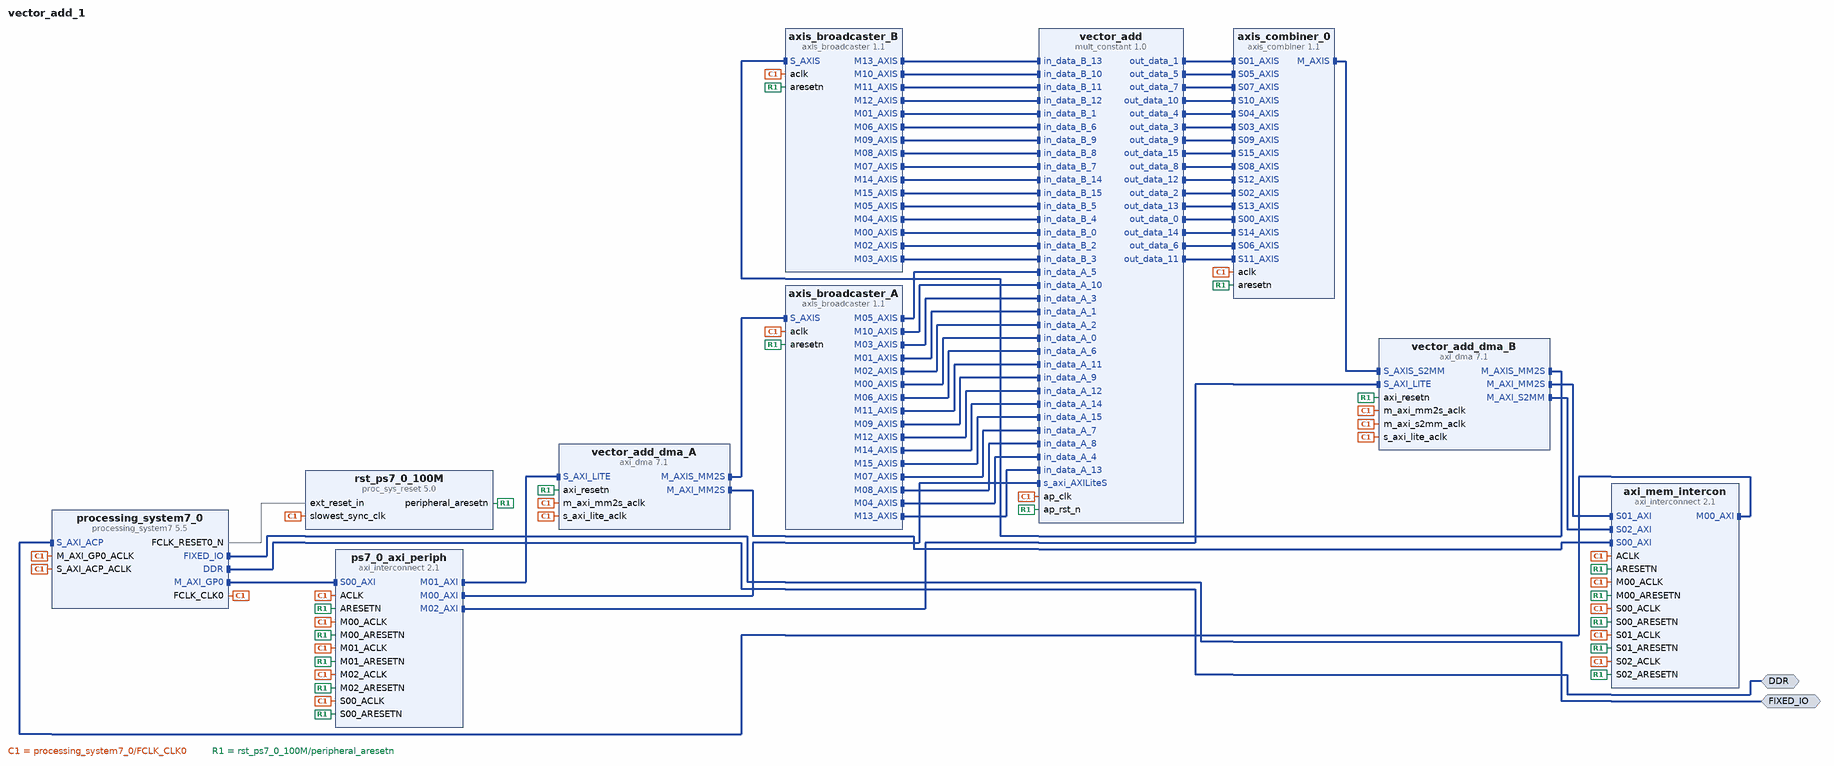
[diagram p0: block diagram of the top level]
# Vivado block design vector_add_1, xc7z020clg400-1, Vivado 2019.2
create_bd_design vector_add_1

create_bd_intf_port -mode Master -vlnv xilinx.com:interface:ddrx_rtl:1.0 DDR
create_bd_intf_port -mode Master -vlnv xilinx.com:display_processing_system7:fixedio_rtl:1.0 FIXED_IO

create_bd_cell -type ip -vlnv xilinx.com:ip:processing_system7:5.5 processing_system7_0
set_property -dict [list \
  CONFIG.PCW_APU_PERIPHERAL_FREQMHZ 650 \
  CONFIG.PCW_CRYSTAL_PERIPHERAL_FREQMHZ 50 \
  CONFIG.PCW_ENET0_ENET0_IO {MIO 16 .. 27} \
  CONFIG.PCW_ENET0_GRP_MDIO_ENABLE 1 \
  CONFIG.PCW_ENET0_GRP_MDIO_IO {MIO 52 .. 53} \
  CONFIG.PCW_ENET0_PERIPHERAL_ENABLE 1 \
  CONFIG.PCW_ENET0_RESET_ENABLE 1 \
  CONFIG.PCW_ENET0_RESET_IO {MIO 9} \
  CONFIG.PCW_ENET_RESET_ENABLE 1 \
  CONFIG.PCW_ENET_RESET_SELECT {Share reset pin} \
  CONFIG.PCW_FPGA0_PERIPHERAL_FREQMHZ 100 \
  CONFIG.PCW_FPGA1_PERIPHERAL_FREQMHZ 50 \
  CONFIG.PCW_GPIO_MIO_GPIO_ENABLE 1 \
  CONFIG.PCW_GPIO_MIO_GPIO_IO MIO \
  CONFIG.PCW_I2C_RESET_ENABLE 1 \
  CONFIG.PCW_M_AXI_GP0_FREQMHZ 10 \
  CONFIG.PCW_PERIPHERAL_BOARD_PRESET None \
  CONFIG.PCW_PRESET_BANK1_VOLTAGE {LVCMOS 1.8V} \
  CONFIG.PCW_QSPI_GRP_FBCLK_ENABLE 1 \
  CONFIG.PCW_QSPI_GRP_FBCLK_IO {MIO 8} \
  CONFIG.PCW_QSPI_GRP_SINGLE_SS_ENABLE 1 \
  CONFIG.PCW_QSPI_GRP_SINGLE_SS_IO {MIO 1 .. 6} \
  CONFIG.PCW_QSPI_PERIPHERAL_ENABLE 1 \
  CONFIG.PCW_QSPI_QSPI_IO {MIO 1 .. 6} \
  CONFIG.PCW_SD0_GRP_CD_ENABLE 1 \
  CONFIG.PCW_SD0_GRP_CD_IO {MIO 47} \
  CONFIG.PCW_SD0_GRP_WP_ENABLE 0 \
  CONFIG.PCW_SD0_PERIPHERAL_ENABLE 1 \
  CONFIG.PCW_SD0_SD0_IO {MIO 40 .. 45} \
  CONFIG.PCW_SDIO_PERIPHERAL_FREQMHZ 50 \
  CONFIG.PCW_SINGLE_QSPI_DATA_MODE x4 \
  CONFIG.PCW_UART0_PERIPHERAL_ENABLE 1 \
  CONFIG.PCW_UART0_UART0_IO {MIO 14 .. 15} \
  CONFIG.PCW_UART1_PERIPHERAL_ENABLE 0 \
  CONFIG.PCW_UART_PERIPHERAL_FREQMHZ 100 \
  CONFIG.PCW_UIPARAM_DDR_BUS_WIDTH {16 Bit} \
  CONFIG.PCW_UIPARAM_DDR_FREQ_MHZ 525 \
  CONFIG.PCW_UIPARAM_DDR_PARTNO {MT41J256M16 RE-125} \
  CONFIG.PCW_USB0_PERIPHERAL_ENABLE 1 \
  CONFIG.PCW_USB0_RESET_ENABLE 1 \
  CONFIG.PCW_USB0_RESET_IO {MIO 46} \
  CONFIG.PCW_USB0_USB0_IO {MIO 28 .. 39} \
  CONFIG.PCW_USB_RESET_ENABLE 1 \
  CONFIG.PCW_USB_RESET_SELECT {Share reset pin} \
  CONFIG.PCW_USE_S_AXI_ACP 1 \
] [get_bd_cells processing_system7_0]
# 483 more settings of processing_system7_0 are not shown: defaults, MIO pin electricals, DDR timing, and values the tool derives
create_bd_cell -type ip -vlnv xilinx.com:ip:axi_dma:7.1 vector_add_dma_A
set_property -dict [list \
  CONFIG.c_include_s2mm 0 \
  CONFIG.c_include_sg 0 \
  CONFIG.c_m_axi_mm2s_data_width 512 \
  CONFIG.c_m_axis_mm2s_tdata_width 512 \
  CONFIG.c_mm2s_burst_size 32 \
] [get_bd_cells vector_add_dma_A]
create_bd_cell -type ip -vlnv Xilinx:hls:mult_constant:1.0 vector_add
create_bd_cell -type ip -vlnv xilinx.com:ip:axis_broadcaster:1.1 axis_broadcaster_A
set_property -dict [list \
  CONFIG.HAS_TLAST 1 \
  CONFIG.M00_TDATA_REMAP {tdata[31:0]} \
  CONFIG.M01_TDATA_REMAP {tdata[63:32]} \
  CONFIG.M02_TDATA_REMAP {tdata[95:64]} \
  CONFIG.M03_TDATA_REMAP {tdata[127:96]} \
  CONFIG.M04_TDATA_REMAP {tdata[159:128]} \
  CONFIG.M05_TDATA_REMAP {tdata[191:160]} \
  CONFIG.M06_TDATA_REMAP {tdata[223:192]} \
  CONFIG.M07_TDATA_REMAP {tdata[255:224]} \
  CONFIG.M08_TDATA_REMAP {tdata[287:256]} \
  CONFIG.M09_TDATA_REMAP {tdata[319:288]} \
  CONFIG.M10_TDATA_REMAP {tdata[351:320]} \
  CONFIG.M11_TDATA_REMAP {tdata[383:352]} \
  CONFIG.M12_TDATA_REMAP {tdata[415:384]} \
  CONFIG.M13_TDATA_REMAP {tdata[447:416]} \
  CONFIG.M14_TDATA_REMAP {tdata[479:448]} \
  CONFIG.M15_TDATA_REMAP {tdata[511:480]} \
  CONFIG.M_TDATA_NUM_BYTES 4 \
  CONFIG.NUM_MI 16 \
  CONFIG.S_TDATA_NUM_BYTES 64 \
] [get_bd_cells axis_broadcaster_A]
create_bd_cell -type ip -vlnv xilinx.com:ip:axis_broadcaster:1.1 axis_broadcaster_B
set_property -dict [list \
  CONFIG.HAS_TLAST 1 \
  CONFIG.M00_TDATA_REMAP {tdata[31:0]} \
  CONFIG.M01_TDATA_REMAP {tdata[63:32]} \
  CONFIG.M02_TDATA_REMAP {tdata[95:64]} \
  CONFIG.M03_TDATA_REMAP {tdata[127:96]} \
  CONFIG.M04_TDATA_REMAP {tdata[159:128]} \
  CONFIG.M05_TDATA_REMAP {tdata[191:160]} \
  CONFIG.M06_TDATA_REMAP {tdata[223:192]} \
  CONFIG.M07_TDATA_REMAP {tdata[255:224]} \
  CONFIG.M08_TDATA_REMAP {tdata[287:256]} \
  CONFIG.M09_TDATA_REMAP {tdata[319:288]} \
  CONFIG.M10_TDATA_REMAP {tdata[351:320]} \
  CONFIG.M11_TDATA_REMAP {tdata[383:352]} \
  CONFIG.M12_TDATA_REMAP {tdata[415:384]} \
  CONFIG.M13_TDATA_REMAP {tdata[447:416]} \
  CONFIG.M14_TDATA_REMAP {tdata[479:448]} \
  CONFIG.M15_TDATA_REMAP {tdata[511:480]} \
  CONFIG.M_TDATA_NUM_BYTES 4 \
  CONFIG.NUM_MI 16 \
  CONFIG.S_TDATA_NUM_BYTES 64 \
] [get_bd_cells axis_broadcaster_B]
create_bd_cell -type ip -vlnv xilinx.com:ip:axi_dma:7.1 vector_add_dma_B
set_property -dict [list \
  CONFIG.c_include_sg 0 \
  CONFIG.c_m_axi_mm2s_data_width 512 \
  CONFIG.c_m_axi_s2mm_data_width 512 \
  CONFIG.c_m_axis_mm2s_tdata_width 512 \
  CONFIG.c_mm2s_burst_size 32 \
  CONFIG.c_s2mm_burst_size 32 \
  CONFIG.c_s_axis_s2mm_tdata_width 512 \
] [get_bd_cells vector_add_dma_B]
create_bd_cell -type ip -vlnv xilinx.com:ip:axis_combiner:1.1 axis_combiner_0
set_property -dict [list \
  CONFIG.HAS_TKEEP 1 \
  CONFIG.HAS_TLAST 1 \
  CONFIG.NUM_SI 16 \
  CONFIG.TDATA_NUM_BYTES 4 \
] [get_bd_cells axis_combiner_0]
create_bd_cell -type ip -vlnv xilinx.com:ip:proc_sys_reset:5.0 rst_ps7_0_100M
create_bd_cell -type ip -vlnv xilinx.com:ip:axi_interconnect:2.1 axi_mem_intercon
set_property -dict {CONFIG.NUM_MI 1 CONFIG.NUM_SI 3} [get_bd_cells axi_mem_intercon]
create_bd_cell -type ip -vlnv xilinx.com:ip:axi_interconnect:2.1 ps7_0_axi_periph
set_property -dict {CONFIG.NUM_MI 3} [get_bd_cells ps7_0_axi_periph]

# ---- connections ----

connect_bd_intf_net [get_bd_intf_pins axis_broadcaster_B/M13_AXIS] [get_bd_intf_pins vector_add/in_data_B_13]
connect_bd_intf_net [get_bd_intf_pins axis_broadcaster_B/M10_AXIS] [get_bd_intf_pins vector_add/in_data_B_10]
connect_bd_intf_net [get_bd_intf_pins axis_broadcaster_B/M11_AXIS] [get_bd_intf_pins vector_add/in_data_B_11]
connect_bd_intf_net [get_bd_intf_pins axis_broadcaster_B/M12_AXIS] [get_bd_intf_pins vector_add/in_data_B_12]
connect_bd_intf_net [get_bd_intf_pins axis_broadcaster_B/M01_AXIS] [get_bd_intf_pins vector_add/in_data_B_1]
connect_bd_intf_net [get_bd_intf_pins axis_broadcaster_B/M06_AXIS] [get_bd_intf_pins vector_add/in_data_B_6]
connect_bd_intf_net [get_bd_intf_pins axis_broadcaster_B/M09_AXIS] [get_bd_intf_pins vector_add/in_data_B_9]
connect_bd_intf_net [get_bd_intf_pins axis_broadcaster_B/M08_AXIS] [get_bd_intf_pins vector_add/in_data_B_8]
connect_bd_intf_net [get_bd_intf_pins vector_add_dma_A/M_AXIS_MM2S] [get_bd_intf_pins axis_broadcaster_A/S_AXIS]
connect_bd_intf_net [get_bd_intf_pins axis_broadcaster_B/M07_AXIS] [get_bd_intf_pins vector_add/in_data_B_7]
connect_bd_intf_net [get_bd_intf_pins axis_broadcaster_B/M14_AXIS] [get_bd_intf_pins vector_add/in_data_B_14]
connect_bd_intf_net [get_bd_intf_pins axis_broadcaster_B/M15_AXIS] [get_bd_intf_pins vector_add/in_data_B_15]
connect_bd_intf_net [get_bd_intf_pins vector_add_dma_B/M_AXIS_MM2S] [get_bd_intf_pins axis_broadcaster_B/S_AXIS]
connect_bd_intf_net [get_bd_intf_pins vector_add/out_data_1] [get_bd_intf_pins axis_combiner_0/S01_AXIS]
connect_bd_intf_net [get_bd_intf_pins vector_add/out_data_5] [get_bd_intf_pins axis_combiner_0/S05_AXIS]
connect_bd_intf_net [get_bd_intf_pins axis_broadcaster_A/M05_AXIS] [get_bd_intf_pins vector_add/in_data_A_5]
connect_bd_intf_net [get_bd_intf_pins axis_combiner_0/M_AXIS] [get_bd_intf_pins vector_add_dma_B/S_AXIS_S2MM]
connect_bd_intf_net [get_bd_intf_pins axis_broadcaster_A/M10_AXIS] [get_bd_intf_pins vector_add/in_data_A_10]
connect_bd_intf_net [get_bd_intf_pins axis_broadcaster_A/M03_AXIS] [get_bd_intf_pins vector_add/in_data_A_3]
connect_bd_intf_net [get_bd_intf_pins axis_broadcaster_A/M01_AXIS] [get_bd_intf_pins vector_add/in_data_A_1]
connect_bd_intf_net [get_bd_intf_pins axis_broadcaster_A/M02_AXIS] [get_bd_intf_pins vector_add/in_data_A_2]
connect_bd_intf_net [get_bd_intf_pins axis_broadcaster_A/M00_AXIS] [get_bd_intf_pins vector_add/in_data_A_0]
connect_bd_intf_net [get_bd_intf_ports FIXED_IO] [get_bd_intf_pins processing_system7_0/FIXED_IO]
connect_bd_intf_net [get_bd_intf_ports DDR] [get_bd_intf_pins processing_system7_0/DDR]
connect_bd_intf_net [get_bd_intf_pins vector_add/out_data_7] [get_bd_intf_pins axis_combiner_0/S07_AXIS]
connect_bd_intf_net [get_bd_intf_pins vector_add/out_data_10] [get_bd_intf_pins axis_combiner_0/S10_AXIS]
connect_bd_intf_net [get_bd_intf_pins vector_add/out_data_4] [get_bd_intf_pins axis_combiner_0/S04_AXIS]
connect_bd_intf_net [get_bd_intf_pins vector_add_dma_B/M_AXI_MM2S] [get_bd_intf_pins axi_mem_intercon/S01_AXI]
connect_bd_intf_net [get_bd_intf_pins axis_broadcaster_B/M05_AXIS] [get_bd_intf_pins vector_add/in_data_B_5]
connect_bd_intf_net [get_bd_intf_pins vector_add/out_data_3] [get_bd_intf_pins axis_combiner_0/S03_AXIS]
connect_bd_intf_net [get_bd_intf_pins vector_add/out_data_9] [get_bd_intf_pins axis_combiner_0/S09_AXIS]
connect_bd_intf_net [get_bd_intf_pins vector_add/out_data_15] [get_bd_intf_pins axis_combiner_0/S15_AXIS]
connect_bd_intf_net [get_bd_intf_pins vector_add/out_data_8] [get_bd_intf_pins axis_combiner_0/S08_AXIS]
connect_bd_intf_net [get_bd_intf_pins vector_add/out_data_12] [get_bd_intf_pins axis_combiner_0/S12_AXIS]
connect_bd_intf_net [get_bd_intf_pins vector_add/out_data_2] [get_bd_intf_pins axis_combiner_0/S02_AXIS]
connect_bd_intf_net [get_bd_intf_pins vector_add/out_data_13] [get_bd_intf_pins axis_combiner_0/S13_AXIS]
connect_bd_intf_net [get_bd_intf_pins vector_add/out_data_0] [get_bd_intf_pins axis_combiner_0/S00_AXIS]
connect_bd_intf_net [get_bd_intf_pins vector_add/out_data_14] [get_bd_intf_pins axis_combiner_0/S14_AXIS]
connect_bd_intf_net [get_bd_intf_pins vector_add/out_data_6] [get_bd_intf_pins axis_combiner_0/S06_AXIS]
connect_bd_intf_net [get_bd_intf_pins vector_add/out_data_11] [get_bd_intf_pins axis_combiner_0/S11_AXIS]
connect_bd_intf_net [get_bd_intf_pins axis_broadcaster_B/M04_AXIS] [get_bd_intf_pins vector_add/in_data_B_4]
connect_bd_intf_net [get_bd_intf_pins axis_broadcaster_A/M06_AXIS] [get_bd_intf_pins vector_add/in_data_A_6]
connect_bd_intf_net [get_bd_intf_pins axis_broadcaster_A/M11_AXIS] [get_bd_intf_pins vector_add/in_data_A_11]
connect_bd_intf_net [get_bd_intf_pins axis_broadcaster_A/M09_AXIS] [get_bd_intf_pins vector_add/in_data_A_9]
connect_bd_intf_net [get_bd_intf_pins axis_broadcaster_A/M12_AXIS] [get_bd_intf_pins vector_add/in_data_A_12]
connect_bd_intf_net [get_bd_intf_pins axis_broadcaster_B/M00_AXIS] [get_bd_intf_pins vector_add/in_data_B_0]
connect_bd_intf_net [get_bd_intf_pins axis_broadcaster_A/M14_AXIS] [get_bd_intf_pins vector_add/in_data_A_14]
connect_bd_intf_net [get_bd_intf_pins axis_broadcaster_A/M15_AXIS] [get_bd_intf_pins vector_add/in_data_A_15]
connect_bd_intf_net [get_bd_intf_pins axis_broadcaster_B/M02_AXIS] [get_bd_intf_pins vector_add/in_data_B_2]
connect_bd_intf_net [get_bd_intf_pins axis_broadcaster_A/M07_AXIS] [get_bd_intf_pins vector_add/in_data_A_7]
connect_bd_intf_net [get_bd_intf_pins axis_broadcaster_A/M08_AXIS] [get_bd_intf_pins vector_add/in_data_A_8]
connect_bd_intf_net [get_bd_intf_pins axis_broadcaster_A/M04_AXIS] [get_bd_intf_pins vector_add/in_data_A_4]
connect_bd_intf_net [get_bd_intf_pins axis_broadcaster_A/M13_AXIS] [get_bd_intf_pins vector_add/in_data_A_13]
connect_bd_intf_net [get_bd_intf_pins axis_broadcaster_B/M03_AXIS] [get_bd_intf_pins vector_add/in_data_B_3]
connect_bd_intf_net [get_bd_intf_pins ps7_0_axi_periph/M00_AXI] [get_bd_intf_pins vector_add/s_axi_AXILiteS]
connect_bd_intf_net [get_bd_intf_pins processing_system7_0/M_AXI_GP0] [get_bd_intf_pins ps7_0_axi_periph/S00_AXI]
connect_bd_intf_net [get_bd_intf_pins vector_add_dma_A/M_AXI_MM2S] [get_bd_intf_pins axi_mem_intercon/S00_AXI]
connect_bd_intf_net [get_bd_intf_pins axi_mem_intercon/M00_AXI] [get_bd_intf_pins processing_system7_0/S_AXI_ACP]
connect_bd_intf_net [get_bd_intf_pins vector_add_dma_B/M_AXI_S2MM] [get_bd_intf_pins axi_mem_intercon/S02_AXI]
connect_bd_intf_net [get_bd_intf_pins ps7_0_axi_periph/M02_AXI] [get_bd_intf_pins vector_add_dma_B/S_AXI_LITE]
connect_bd_intf_net [get_bd_intf_pins ps7_0_axi_periph/M01_AXI] [get_bd_intf_pins vector_add_dma_A/S_AXI_LITE]
connect_bd_net [get_bd_pins processing_system7_0/FCLK_CLK0] \
  [get_bd_pins axis_broadcaster_A/aclk] [get_bd_pins vector_add/ap_clk] [get_bd_pins vector_add_dma_A/m_axi_mm2s_aclk] \
  [get_bd_pins rst_ps7_0_100M/slowest_sync_clk] [get_bd_pins axis_broadcaster_B/aclk] \
  [get_bd_pins vector_add_dma_B/m_axi_mm2s_aclk] [get_bd_pins axis_combiner_0/aclk] \
  [get_bd_pins vector_add_dma_B/m_axi_s2mm_aclk] [get_bd_pins axi_mem_intercon/S00_ACLK] \
  [get_bd_pins processing_system7_0/S_AXI_ACP_ACLK] [get_bd_pins axi_mem_intercon/M00_ACLK] \
  [get_bd_pins axi_mem_intercon/ACLK] [get_bd_pins ps7_0_axi_periph/M00_ACLK] \
  [get_bd_pins processing_system7_0/M_AXI_GP0_ACLK] [get_bd_pins ps7_0_axi_periph/S00_ACLK] \
  [get_bd_pins ps7_0_axi_periph/ACLK] [get_bd_pins vector_add_dma_A/s_axi_lite_aclk] [get_bd_pins ps7_0_axi_periph/M01_ACLK] \
  [get_bd_pins vector_add_dma_B/s_axi_lite_aclk] [get_bd_pins ps7_0_axi_periph/M02_ACLK] \
  [get_bd_pins axi_mem_intercon/S01_ACLK] [get_bd_pins axi_mem_intercon/S02_ACLK]
connect_bd_net [get_bd_pins processing_system7_0/FCLK_RESET0_N] [get_bd_pins rst_ps7_0_100M/ext_reset_in]
connect_bd_net [get_bd_pins rst_ps7_0_100M/peripheral_aresetn] \
  [get_bd_pins axis_broadcaster_A/aresetn] [get_bd_pins vector_add/ap_rst_n] [get_bd_pins axis_broadcaster_B/aresetn] \
  [get_bd_pins axis_combiner_0/aresetn] [get_bd_pins axi_mem_intercon/S00_ARESETN] [get_bd_pins axi_mem_intercon/M00_ARESETN] \
  [get_bd_pins axi_mem_intercon/ARESETN] [get_bd_pins ps7_0_axi_periph/M00_ARESETN] \
  [get_bd_pins ps7_0_axi_periph/S00_ARESETN] [get_bd_pins ps7_0_axi_periph/ARESETN] [get_bd_pins vector_add_dma_A/axi_resetn] \
  [get_bd_pins ps7_0_axi_periph/M01_ARESETN] [get_bd_pins vector_add_dma_B/axi_resetn] \
  [get_bd_pins ps7_0_axi_periph/M02_ARESETN] [get_bd_pins axi_mem_intercon/S01_ARESETN] \
  [get_bd_pins axi_mem_intercon/S02_ARESETN]

# ---- address map ----
assign_bd_address -offset 0x40400000 -range 64K -target_address_space [get_bd_addr_spaces processing_system7_0/Data] [get_bd_addr_segs vector_add_dma_A/S_AXI_LITE/Reg]
assign_bd_address -offset 0x40410000 -range 64K -target_address_space [get_bd_addr_spaces processing_system7_0/Data] [get_bd_addr_segs vector_add_dma_B/S_AXI_LITE/Reg]
assign_bd_address -offset 0x43C00000 -range 64K -target_address_space [get_bd_addr_spaces processing_system7_0/Data] [get_bd_addr_segs vector_add/s_axi_AXILiteS/Reg]
assign_bd_address -offset 0x00000000 -range 512M -target_address_space [get_bd_addr_spaces vector_add_dma_A/Data_MM2S] [get_bd_addr_segs processing_system7_0/S_AXI_ACP/ACP_DDR_LOWOCM]
assign_bd_address -offset 0xFC000000 -range 16M -target_address_space [get_bd_addr_spaces vector_add_dma_A/Data_MM2S] [get_bd_addr_segs processing_system7_0/S_AXI_ACP/ACP_QSPI_LINEAR]
exclude_bd_addr_seg -offset 0x00000000 -range 1 -target_address_space [get_bd_addr_spaces vector_add_dma_A/Data_MM2S] [get_bd_addr_segs processing_system7_0/S_AXI_ACP/ACP_IOP]
exclude_bd_addr_seg -offset 0x00000000 -range 1 -target_address_space [get_bd_addr_spaces vector_add_dma_A/Data_MM2S] [get_bd_addr_segs processing_system7_0/S_AXI_ACP/ACP_M_AXI_GP0]
exclude_bd_addr_seg -offset 0x40000000 -range 1G -target_address_space [get_bd_addr_spaces vector_add_dma_A/Data_MM2S] [get_bd_addr_segs processing_system7_0/S_AXI_ACP/ACP_M_AXI_GP0]
exclude_bd_addr_seg -offset 0xE0000000 -range 4M -target_address_space [get_bd_addr_spaces vector_add_dma_A/Data_MM2S] [get_bd_addr_segs processing_system7_0/S_AXI_ACP/ACP_IOP]
assign_bd_address -offset 0x00000000 -range 512M -target_address_space [get_bd_addr_spaces vector_add_dma_B/Data_MM2S] [get_bd_addr_segs processing_system7_0/S_AXI_ACP/ACP_DDR_LOWOCM]
assign_bd_address -offset 0xFC000000 -range 16M -target_address_space [get_bd_addr_spaces vector_add_dma_B/Data_MM2S] [get_bd_addr_segs processing_system7_0/S_AXI_ACP/ACP_QSPI_LINEAR]
exclude_bd_addr_seg -offset 0x40000000 -range 1G -target_address_space [get_bd_addr_spaces vector_add_dma_B/Data_MM2S] [get_bd_addr_segs processing_system7_0/S_AXI_ACP/ACP_M_AXI_GP0]
exclude_bd_addr_seg -offset 0xE0000000 -range 4M -target_address_space [get_bd_addr_spaces vector_add_dma_B/Data_MM2S] [get_bd_addr_segs processing_system7_0/S_AXI_ACP/ACP_IOP]
assign_bd_address -offset 0x00000000 -range 512M -target_address_space [get_bd_addr_spaces vector_add_dma_B/Data_S2MM] [get_bd_addr_segs processing_system7_0/S_AXI_ACP/ACP_DDR_LOWOCM]
assign_bd_address -offset 0xFC000000 -range 16M -target_address_space [get_bd_addr_spaces vector_add_dma_B/Data_S2MM] [get_bd_addr_segs processing_system7_0/S_AXI_ACP/ACP_QSPI_LINEAR]
exclude_bd_addr_seg -offset 0x40000000 -range 1G -target_address_space [get_bd_addr_spaces vector_add_dma_B/Data_S2MM] [get_bd_addr_segs processing_system7_0/S_AXI_ACP/ACP_M_AXI_GP0]
exclude_bd_addr_seg -offset 0xE0000000 -range 4M -target_address_space [get_bd_addr_spaces vector_add_dma_B/Data_S2MM] [get_bd_addr_segs processing_system7_0/S_AXI_ACP/ACP_IOP]

validate_bd_design
save_bd_design
